# EAGLE design QFN10_2x2 (EAGLE 9.6.2)
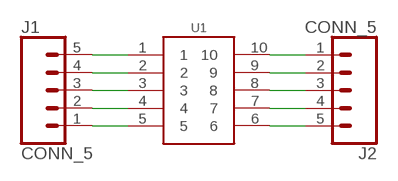
[diagram p0: schematic, sheet 1]

## Parts
J1  CONN_5  [1X05]
J2  CONN_5  [1X05]
U1  GEN_10QFN10_2X2  [QFN10_SI114X]

## Nets
N$1: J1.5 U1.1
N$2: J1.4 U1.2
N$3: J1.3 U1.3
N$4: J1.2 U1.4
N$5: J1.1 U1.5
N$6: J2.5 U1.6
N$7: J2.4 U1.7
N$8: J2.3 U1.8
N$9: J2.2 U1.9
N$10: J2.1 U1.10

## Library data of the parts
J1 J2 = bschulz:CONN_5: Genaric 5 terminal header
U1 = bschulz:GEN_10: Generic 10 Pin Package for Breakout Boards

## Board
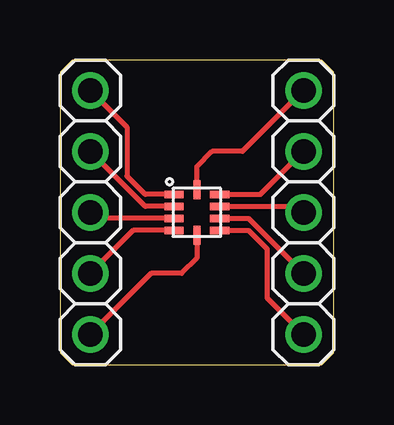
[diagram p1: board, top side]

Size 11.43 x 12.7 mm. Coordinates in mm from the lower left corner, seen from the top.
Outline: 0,12.2 0,0.5 0.5,0 10.93,0 11.43,0.5 11.43,12.2 10.93,12.7 0.5,12.7 0,12.2
Copper layers (1*16): Top 0.035559375mm / dielectric 1.6mm / Bottom 0.035559375mm
Design rules "oshpark-2layer": minimum track width 6mil, minimum drill 10mil, track to track 6mil, track to pad 6mil, pad to pad 6mil, via to via 6mil, smd to smd 6mil, copper to edge 15mil, drill to drill 6mil, minimum pad ring 5mil, minimum via ring 5mil, stop-mask expansion 2.5mil, vias tented up to drill 0mil, thermal gap 10mil

### Footprints (pad centres in the part's own frame; a part is rotated, then mirrored left to right if it is on the bottom)
1X05 = drill 1.016: 1 -5.08,0; 2 -2.54,0; 3 0,0; 4 2.54,0; 5 5.08,0
QFN10_SI114X = smd 0.8 x 0.3: 1 -0.95,0.75; 2 -0.95,0.25; 3 -0.95,-0.25; 4 -0.95,-0.75; 6 0.95,-0.75; 7 0.95,-0.25; 8 0.95,0.25; 9 0.95,0.75 | smd 0.3 x 0.8: 5 0,-0.95; 10 0,0.95

### Placement (x,y rotation side)
J1  1.27,6.35 90 top
J2  10.16,6.35 270 top
U1  5.71,6.35 0 top

### Tracks (layer width: path | path; a pad name or v marks a point on that pad's centre or on a via)
N$1
  Top 0.2: U1.1 3.56,7.1 2.79,7.87 2.79,9.91 J1.5
N$2
  Top 0.2: U1.2 3.56,6.6 J1.4
N$3
  Top 0.2: U1.3 1.52,6.1 J1.3
N$4
  Top 0.2: U1.4 3.06,5.6 J1.2
N$5
  Top 0.2: U1.5 5.71,4.45 5.08,3.81 3.81,3.81 J1.1
N$6
  Top 0.2: U1.6 7.87,5.6 8.64,4.83 8.64,2.79 J2.5
N$7
  Top 0.2: U1.7 7.87,6.1 J2.4
N$8
  Top 0.2: U1.8 9.91,6.6 J2.3
N$9
  Top 0.2: U1.9 8.37,7.1 J2.2
N$10
  Top 0.2: U1.10 5.71,8.26 6.35,8.89 7.62,8.89 J2.1

### Text on the board
tDocu: 1 | 10 | QFN-10 / 2x2mm | 2 | 9 | 3 | 8 | 4 | 7 | Break44 / B. Schulz | 5 | 6